# Altium schematic sheet fpga.SchDoc
size A; DocumentNumber: 5; SheetNumber: 5; SheetTotal: 6
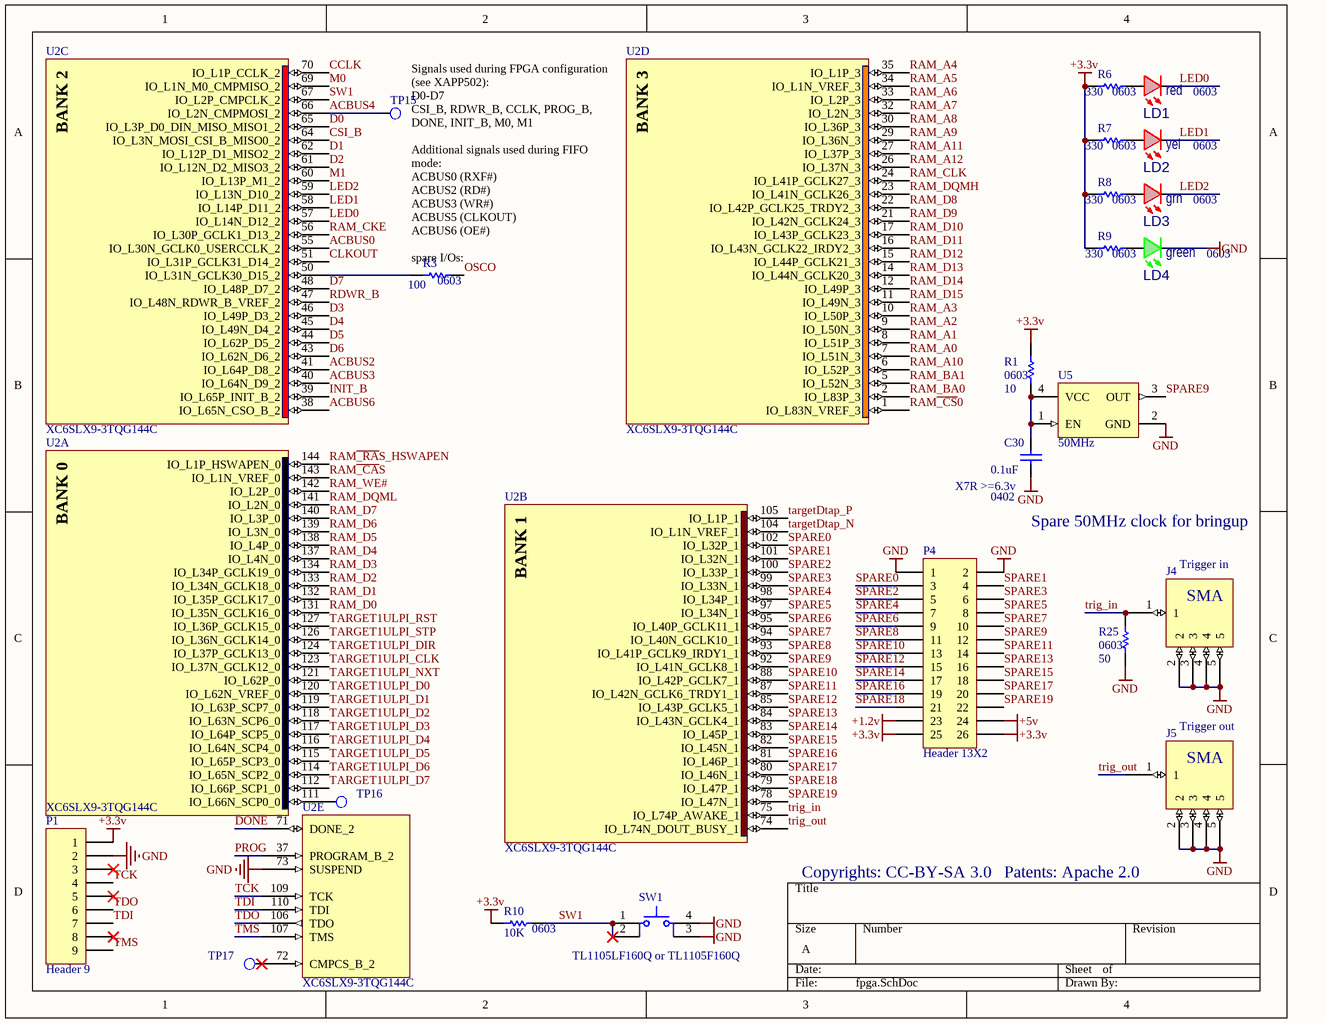
[diagram p0: fpga.SchDoc]

## Parts
C30  value 0.1uF  PackageReference: 0402  Rating: X7R >=6.3v  [CAPC1005N]  (hidden comment: Cap Semi)
J4  Trigger in  [EMPCB.SMAFSTJ.C.HT]
J5  Trigger out  [EMPCB.SMAFSTJ.C.HT]
LD1  value red  PackageReference: 0603  [LED 0603]  (hidden comment: RED-LED)
LD2  value yel  PackageReference: 0603  [LED 0603]  (hidden comment: RED-LED)
LD3  value grn  PackageReference: 0603  [LED 0603]  (hidden comment: RED-LED)
LD4  value green  PackageReference: 0603  [LED 0603]  (hidden comment: GREEN-LED)
P1  Header 9  [HDR1X9]  (no BOM)
P4  Header 13X2  [HDR2X13]
R1  value 10  PackageReference: 0603  [RESC1608N]  (hidden comment: Res Semi)
R3  value 100  PackageReference: 0603  [RESC1608N]  (hidden comment: Res Semi)
R6  value 330  PackageReference: 0603  [RESC1608N]  (hidden comment: Res Semi)
R7  value 330  PackageReference: 0603  [RESC1608N]  (hidden comment: Res Semi)
R8  value 330  PackageReference: 0603  [RESC1608N]  (hidden comment: Res Semi)
R9  value 330  PackageReference: 0603  [RESC1608N]  (hidden comment: Res Semi)
R10  value 10K  PackageReference: 0603  [RESC1608N]  (hidden comment: Res Semi)
R25  value 50  PackageReference: 0603  [RESC1608N]  (hidden comment: Res Semi)
SW1  value TL1105LF160Q or TL1105F160Q  [TL1105]  (hidden comment: 4pin button)
TP15  Test Point  [testpoint]  (value not drawn)  (no BOM)
TP16  Test Point  [testpoint]  (value not drawn)  (no BOM)
TP17  Test Point  [testpoint]  (value not drawn)  (no BOM)
U2  XC6SLX9-3TQG144C  [TQG144_N]  (parts A,B,C,D,E of 7)
U5  value 50MHz  [ASEMB 3.2x2.5 oscillator]

## Nets
+1.2v: P4.23
+3.3v: P1.1 P4.25 P4.26 R1.1 R6.2 R7.2 R8.2 R9.2 R10.2
+5v: P4.24
GND: C30.1 J4.2 J4.3 J4.4 J4.5 J5.2 J5.3 J5.4 J5.5 LD4.C(C-) P1.2 P4.1 P4.2 R25.2 SW1.3 SW1.4 U2.73(SUSPEND) U5.2(GND)
ACBUS0: U2.55(IO_L30N_GCLK0_USERCCLK_2)
ACBUS2: U2.41(IO_L64P_D8_2)
ACBUS3: U2.40(IO_L64N_D9_2)
ACBUS4: TP15.1(pin) U2.66(IO_L2N_CMPMOSI_2)
ACBUS6: U2.38(IO_L65N_CSO_B_2)
CCLK: U2.70(IO_L1P_CCLK_2)
CLKOUT: U2.51(IO_L31P_GCLK31_D14_2)
CSI_B: U2.64(IO_L3N_MOSI_CSI_B_MISO0_2)
D0: U2.65(IO_L3P_D0_DIN_MISO_MISO1_2)
D1: U2.62(IO_L12P_D1_MISO2_2)
D2: U2.61(IO_L12N_D2_MISO3_2)
D3: U2.46(IO_L49P_D3_2)
D4: U2.45(IO_L49N_D4_2)
D5: U2.44(IO_L62P_D5_2)
D6: U2.43(IO_L62N_D6_2)
D7: U2.48(IO_L48P_D7_2)
DONE: U2.71(DONE_2)
INIT_B: U2.39(IO_L65P_INIT_B_2)
LED0: LD1.C(C-) U2.57(IO_L14N_D12_2)
LED1: LD2.C(C-) U2.58(IO_L14P_D11_2)
LED2: LD3.C(C-) U2.59(IO_L13N_D10_2)
M0: U2.69(IO_L1N_M0_CMPMISO_2)
M1: U2.60(IO_L13P_M1_2)
OSCO: R3.1
PROG: U2.37(PROGRAM_B_2)
RAM~{_CA}S: U2.143(IO_L1N_VREF_0)
RAM~{_CS}0: U2.1(IO_L83N_VREF_3)
RAM~{_RA}S_HSWAPEN: U2.144(IO_L1P_HSWAPEN_0)
RAM_A0: U2.7(IO_L51N_3)
RAM_A1: U2.8(IO_L51P_3)
RAM_A2: U2.9(IO_L50N_3)
RAM_A3: U2.10(IO_L50P_3)
RAM_A4: U2.35(IO_L1P_3)
RAM_A5: U2.34(IO_L1N_VREF_3)
RAM_A6: U2.33(IO_L2P_3)
RAM_A7: U2.32(IO_L2N_3)
RAM_A8: U2.30(IO_L36P_3)
RAM_A9: U2.29(IO_L36N_3)
RAM_A10: U2.6(IO_L52P_3)
RAM_A11: U2.27(IO_L37P_3)
RAM_A12: U2.26(IO_L37N_3)
RAM_BA0: U2.2(IO_L83P_3)
RAM_BA1: U2.5(IO_L52N_3)
RAM_CKE: U2.56(IO_L30P_GCLK1_D13_2)
RAM_CLK: U2.24(IO_L41P_GCLK27_3)
RAM_D0: U2.131(IO_L35N_GCLK16_0)
RAM_D1: U2.132(IO_L35P_GCLK17_0)
RAM_D2: U2.133(IO_L34N_GCLK18_0)
RAM_D3: U2.134(IO_L34P_GCLK19_0)
RAM_D4: U2.137(IO_L4N_0)
RAM_D5: U2.138(IO_L4P_0)
RAM_D6: U2.139(IO_L3N_0)
RAM_D7: U2.140(IO_L3P_0)
RAM_D8: U2.22(IO_L42P_GCLK25_TRDY2_3)
RAM_D9: U2.21(IO_L42N_GCLK24_3)
RAM_D10: U2.17(IO_L43P_GCLK23_3)
RAM_D11: U2.16(IO_L43N_GCLK22_IRDY2_3)
RAM_D12: U2.15(IO_L44P_GCLK21_3)
RAM_D13: U2.14(IO_L44N_GCLK20_3)
RAM_D14: U2.12(IO_L49P_3)
RAM_D15: U2.11(IO_L49N_3)
RAM_DQMH: U2.23(IO_L41N_GCLK26_3)
RAM_DQML: U2.141(IO_L2N_0)
RAM_WE#: U2.142(IO_L2P_0)
RDWR_B: U2.47(IO_L48N_RDWR_B_VREF_2)
SPARE0: P4.3 U2.102(IO_L32P_1)
SPARE1: P4.4 U2.101(IO_L32N_1)
SPARE2: P4.5 U2.100(IO_L33P_1)
SPARE3: P4.6 U2.99(IO_L33N_1)
SPARE4: P4.7 U2.98(IO_L34P_1)
SPARE5: P4.8 U2.97(IO_L34N_1)
SPARE6: P4.9 U2.95(IO_L40P_GCLK11_1)
SPARE7: P4.10 U2.94(IO_L40N_GCLK10_1)
SPARE8: P4.11 U2.93(IO_L41P_GCLK9_IRDY1_1)
SPARE9: P4.12 U2.92(IO_L41N_GCLK8_1) U5.3(OUT)
SPARE10: P4.13 U2.88(IO_L42P_GCLK7_1)
SPARE11: P4.14 U2.87(IO_L42N_GCLK6_TRDY1_1)
SPARE12: P4.15 U2.85(IO_L43P_GCLK5_1)
SPARE13: P4.16 U2.84(IO_L43N_GCLK4_1)
SPARE14: P4.17 U2.83(IO_L45P_1)
SPARE15: P4.18 U2.82(IO_L45N_1)
SPARE16: P4.19 U2.81(IO_L46P_1)
SPARE17: P4.20 U2.80(IO_L46N_1)
SPARE18: P4.21 U2.79(IO_L47P_1)
SPARE19: P4.22 U2.78(IO_L47N_1)
SW1: R10.1 SW1.1 SW1.2 U2.67(IO_L2P_CMPCLK_2)
TARGET1ULPI_CLK: U2.123(IO_L37N_GCLK12_0)
TARGET1ULPI_D0: U2.120(IO_L62N_VREF_0)
TARGET1ULPI_D1: U2.119(IO_L63P_SCP7_0)
TARGET1ULPI_D2: U2.118(IO_L63N_SCP6_0)
TARGET1ULPI_D3: U2.117(IO_L64P_SCP5_0)
TARGET1ULPI_D4: U2.116(IO_L64N_SCP4_0)
TARGET1ULPI_D5: U2.115(IO_L65P_SCP3_0)
TARGET1ULPI_D6: U2.114(IO_L65N_SCP2_0)
TARGET1ULPI_D7: U2.112(IO_L66P_SCP1_0)
TARGET1ULPI_DIR: U2.124(IO_L37P_GCLK13_0)
TARGET1ULPI_NXT: U2.121(IO_L62P_0)
TARGET1ULPI_RST: U2.127(IO_L36P_GCLK15_0)
TARGET1ULPI_STP: U2.126(IO_L36N_GCLK14_0)
targetDtap_N: U2.104(IO_L1N_VREF_1)
targetDtap_P: U2.105(IO_L1P_1)
TCK: P1.4 U2.109(TCK)
TDI: P1.7 U2.110(TDI)
TDO: P1.6 U2.106(TDO)
TMS: P1.9 U2.107(TMS)
trig_in: J4.1 R25.1 U2.75(IO_L74P_AWAKE_1)
trig_out: J5.1 U2.74(IO_L74N_DOUT_BUSY_1)
NetC30_2: C30.2 R1.2 U5.1(EN) U5.4(VCC)
NetLD1_A: LD1.A(A+) R6.1
NetLD2_A: LD2.A(A+) R7.1
NetLD3_A: LD3.A(A+) R8.1
NetLD4_A: LD4.A(A+) R9.1
NetR3_2: R3.2 U2.50(IO_L31N_GCLK30_D15_2)
NetTP16_1: TP16.1(pin) U2.111(IO_L66N_SCP0_0)
NetTP17_1: TP17.1(pin) U2.72(CMPCS_B_2)

Not connected (* = marked no-connect by the designer): P1 3* 5* 8*

## Notes on the sheet
- Signals used during FPGA configuration (see XAPP502):
  D0-D7
  CSI_B, RDWR_B, CCLK, PROG_B, DONE, INIT_B, M0, M1
  Additional signals used during FIFO mode:
  ACBUS0 (RXF#)
  ACBUS2 (RD#)
  ACBUS3 (WR#)
  ACBUS5 (CLKOUT)
  ACBUS6 (OE#)
  spare I/Os:
- Spare 50MHz clock for bringup
- Copyrights: CC-BY-SA 3.0
- Patents: Apache 2.0
- (in symbol EMPCB.SMAFSTJ.C.HT) SMA
- (in symbol XC6SLX9-3TQG144C, part A) BANK 0
- (in symbol XC6SLX9-3TQG144C, part B) BANK 1
- (in symbol XC6SLX9-3TQG144C, part C) BANK 2
- (in symbol XC6SLX9-3TQG144C, part D) BANK 3

## Library data of the parts
C30 = Cap Semi: Capacitor (Semiconductor SIM Model); Description: CAP CER 0.1UF 25V 10% X5R 0603; Tolerance: ±10%; Substitutable: yes; Supplier 1: Digi-Key; Supplier Part Number 1: 445-4703-1-ND; Supplier 2: Digi-Key; Supplier Part Number 2: 445-6854-1-ND
J4 J5 = EMPCB.SMAFSTJ.C.HT: PCB edge mount SMA jack
LD1-LD3 = RED-LED-SMD: Substitutable: yes; Supplier 1: Mouser; Supplier Part Number 1: 755-SML-310VTT86
LD4 = GREEN-LED-SMD: Substitutable: yes; Supplier 1: Mouser; Supplier Part Number 1: 645-598-8060-107F
P1 = Header 9: Header, 9-Pin; Substitutable: DNP
P4 = Header 13X2: Header, 13-Pin, Dual row; LatestRevisionDate: 17-Jul-2002; LatestRevisionNote: Re-released for DXP Platform.; Publisher: Altium Limited
R1 R3 R6-R10 R25 = Res Semi: Semiconductor Resistor; Rating: 5%; Substitutable: yes
SW1 = KMS221G_LFS: Substitutable: no; Supplier 1: Mouser; Supplier Part Number 1: 612-TL1105LF; PackageReference: 4-pin thu-hole
TP15-TP17 = Test Pad: Substitutable: DNP
U2 = XC6SLX9-3TQG144C: Spartan-6 LX 1.2V FPGA, 102 User I/Os, 144-Pin TQFP (0.5mm Pitch), Speed Grade 3, Commercial Grade, Pb-Free; Substitutable: no; PackageReference: TQG144; Value: XC6SLX9-3TQG144C
U5 = OSC-4P: Oscillator; Substitutable: no; PackageReference: 3.2x2.5